# EAGLE design AOA-control-revD-sink (EAGLE 7.0.0)
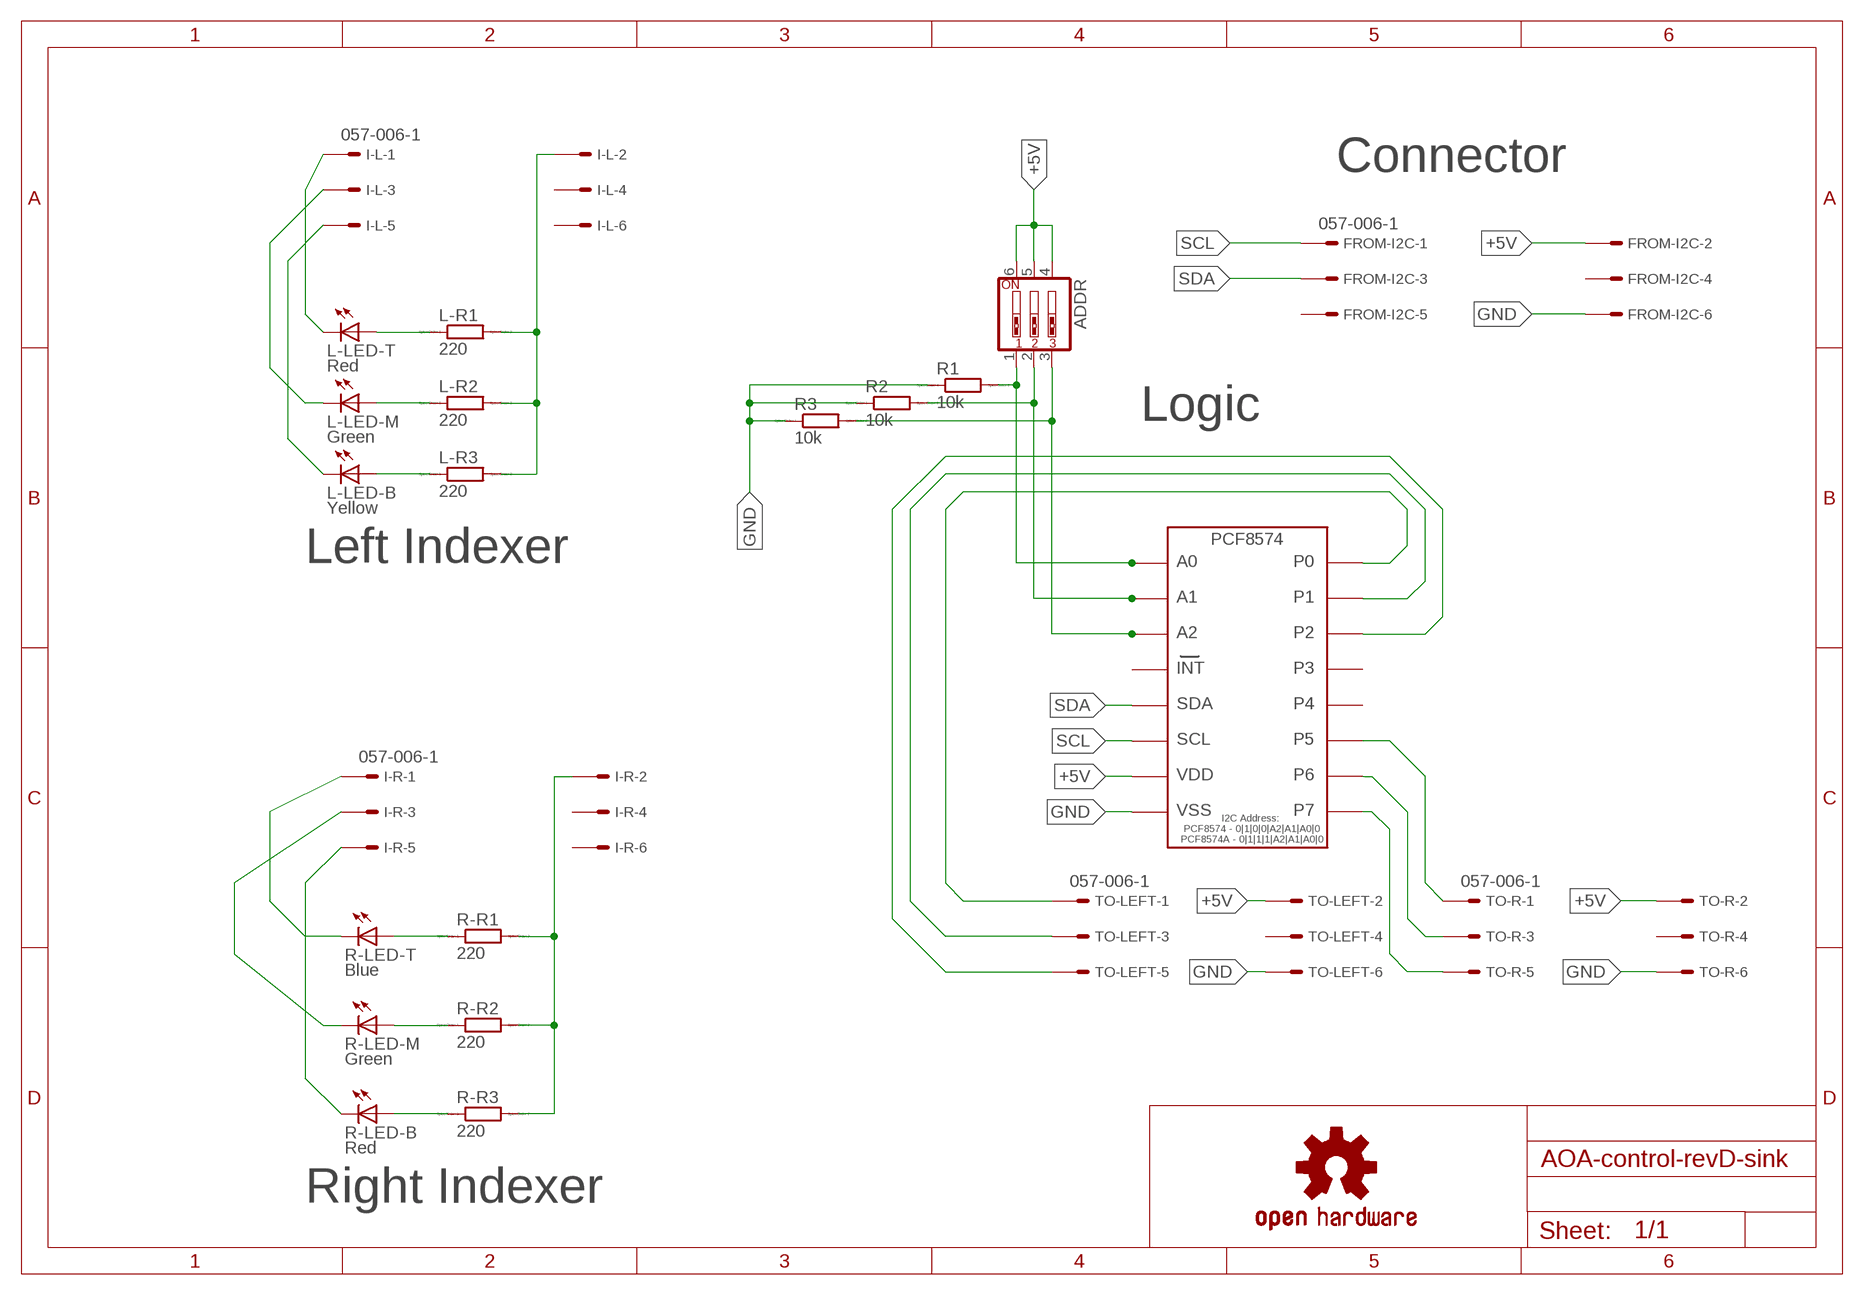
[diagram p0: schematic, sheet 1]

## Parts
ADDR  SW_DIP-3  [EDG-03]
FROM-I2C  057-006-1  [057-006-1]
I-L  057-006-1  [057-006-1]
I-R  057-006-1  [057-006-1]
L-LED-B  Yellow  LED-2AC-CP41B-WGS  [CP41B]
L-LED-M  Green  LED-2AC-CP41B-WGS  [CP41B]
L-LED-T  Red  LED-2AC-CP41B-WGS  [CP41B]
L-R1  220  R0204/7  [0204/7]
L-R2  220  R0204/7  [0204/7]
L-R3  220  R0204/7  [0204/7]
LOGO1  OSHW-LOGOS  [OSHW-LOGO-S]
R1  10k  R0204/7  [0204/7]
R2  10k  R0204/7  [0204/7]
R3  10k  R0204/7  [0204/7]
R-LED-B  Red  LED-2AC-CP41B-WGS  [CP41B]
R-LED-M  Green  LED-2AC-CP41B-WGS  [CP41B]
R-LED-T  Blue  LED-2AC-CP41B-WGS  [CP41B]
R-R1  220  R0204/7  [0204/7]
R-R2  220  R0204/7  [0204/7]
R-R3  220  R0204/7  [0204/7]
TO-LEFT  057-006-1  [057-006-1]
TO-R  057-006-1  [057-006-1]
U$1  PCF8574P/AP  [DIP16]

## Nets
5V-L [Power]: I-L.2 L-R1.2 L-R2.2 L-R3.2
5V-R [Power]: I-R.2 R-R1.2 R-R2.2 R-R3.2
+5V [Power]: ADDR.4 ADDR.5 ADDR.6 FROM-I2C.2 TO-LEFT.2 TO-R.2 U$1.VDD
A0 [Signal]: ADDR.1 R1.2 U$1.A0
A1 [Signal]: ADDR.2 R2.2 U$1.A1
A2 [Signal]: ADDR.3 R3.2 U$1.A2
GND [Power]: FROM-I2C.6 R1.1 R2.1 R3.1 TO-LEFT.6 TO-R.6 U$1.VSS
N$1 [Signal]: I-L.1 L-LED-T.1(C) L-LED-T.4(C)
N$2 [Signal]: I-L.3 L-LED-M.1(C) L-LED-M.4(C)
N$3 [Signal]: I-L.5 L-LED-B.1(C) L-LED-B.4(C)
N$4: R-LED-B.2(A) R-LED-B.3(A) R-R3.1
N$5 [Signal]: I-R.1 R-LED-T.1(C) R-LED-T.4(C)
N$6 [Signal]: I-R.3 R-LED-M.1(C) R-LED-M.4(C)
N$7 [Signal]: I-R.5 R-LED-B.1(C) R-LED-B.4(C)
N$8: R-LED-M.2(A) R-LED-M.3(A) R-R2.1
N$9: R-LED-T.2(A) R-LED-T.3(A) R-R1.1
N$10: L-LED-T.2(A) L-LED-T.3(A) L-R1.1
N$11 [Signal]: TO-LEFT.1 U$1.P0
N$12: L-LED-M.2(A) L-LED-M.3(A) L-R2.1
N$13: L-LED-B.2(A) L-LED-B.3(A) L-R3.1
N$14 [Signal]: TO-LEFT.3 U$1.P1
N$15 [Signal]: TO-LEFT.5 U$1.P2
N$16 [Signal]: TO-R.1 U$1.P5
N$17 [Signal]: TO-R.3 U$1.P6
N$18 [Signal]: TO-R.5 U$1.P7
SCL [Signal]: FROM-I2C.1 U$1.SCL
SDA [Signal]: FROM-I2C.3 U$1.SDA
Unconnected: FROM-I2C.4 FROM-I2C.5 I-L.4 I-L.6 I-R.4 I-R.6 TO-LEFT.4 TO-R.4 U$1.INT U$1.P3 U$1.P4

## Notes on the sheet
- Connector
- Logic
- Left Indexer
- Right Indexer

## Library data of the parts
ADDR = special:SW_DIP-3: DIP SWITCH
FROM-I2C I-L I-R TO-LEFT TO-R = con-panduit:057-006-: CONNECTOR 6-pin series 057 contact pc board low profile headers; OC_FARNELL: unknown; OC_NEWARK: unknown
L-LED-B L-LED-M L-LED-T R-LED-B R-LED-M R-LED-T = led:LED-2AC-: LEDs with 2 Cathode & 2 Anode - Kingbright SUPER FLUX LED LAMP Source: www.us.kingbright.com/images/catalog/SPEC/W7676CPBC-H.pdf Cree® P4 LED CP41B-WES/WGS Source: Data sheet <http://www.cree.com/products/pdf/LEDlamps/CP41B-WES&WGS.pdf>
L-R1-L-R3 R1-R3 R-R1-R-R3 = eagle-ltspice:R: RESISTOR, European symbol; SPICEMODEL: NONE; SPICEPREFIX: R
LOGO1 = SparkFun-Aesthetics:OSHW-LOGO: Open Source Hardware Logo This logo indicates the piece of hardware it is found on incorporates a OSHW license and/or adheres to the definition of open source hardware found here: http://freedomdefined.org/OSHW
U$1 = Uri_ba:PCF8574: NXP PCF8574 I2C 8 bit I/O expander

## Net classes
1 Signal: width 0.254 mm, drill 0.254 mm, clearance 0.254 mm
2 Power: width 0.406 mm, drill 0.406 mm, clearance 0.406 mm

## Board
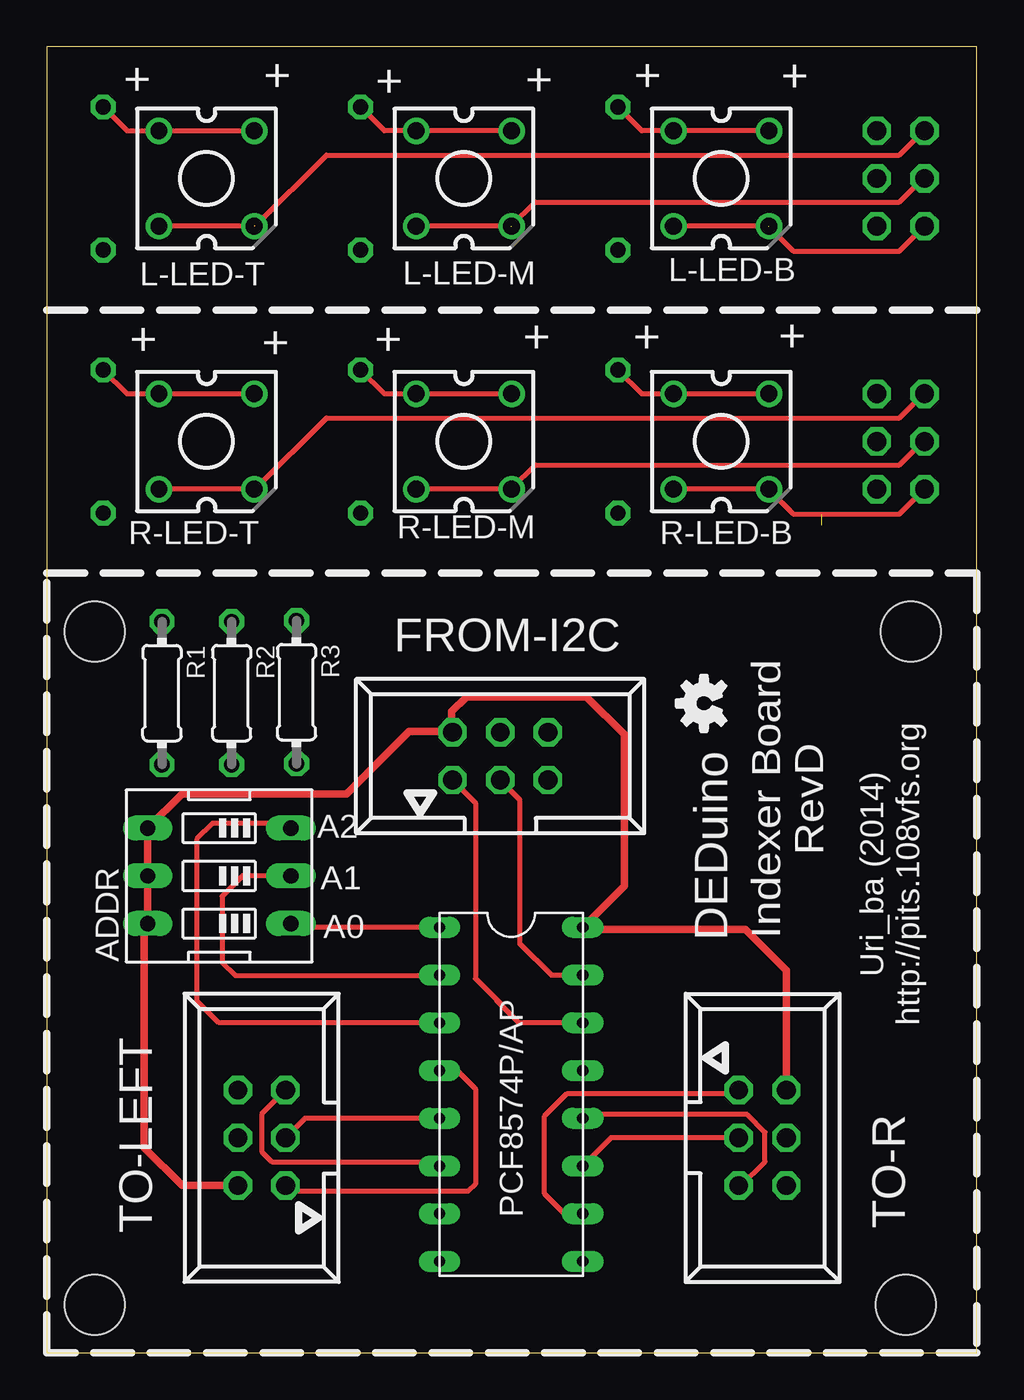
[diagram p1: board, top side]
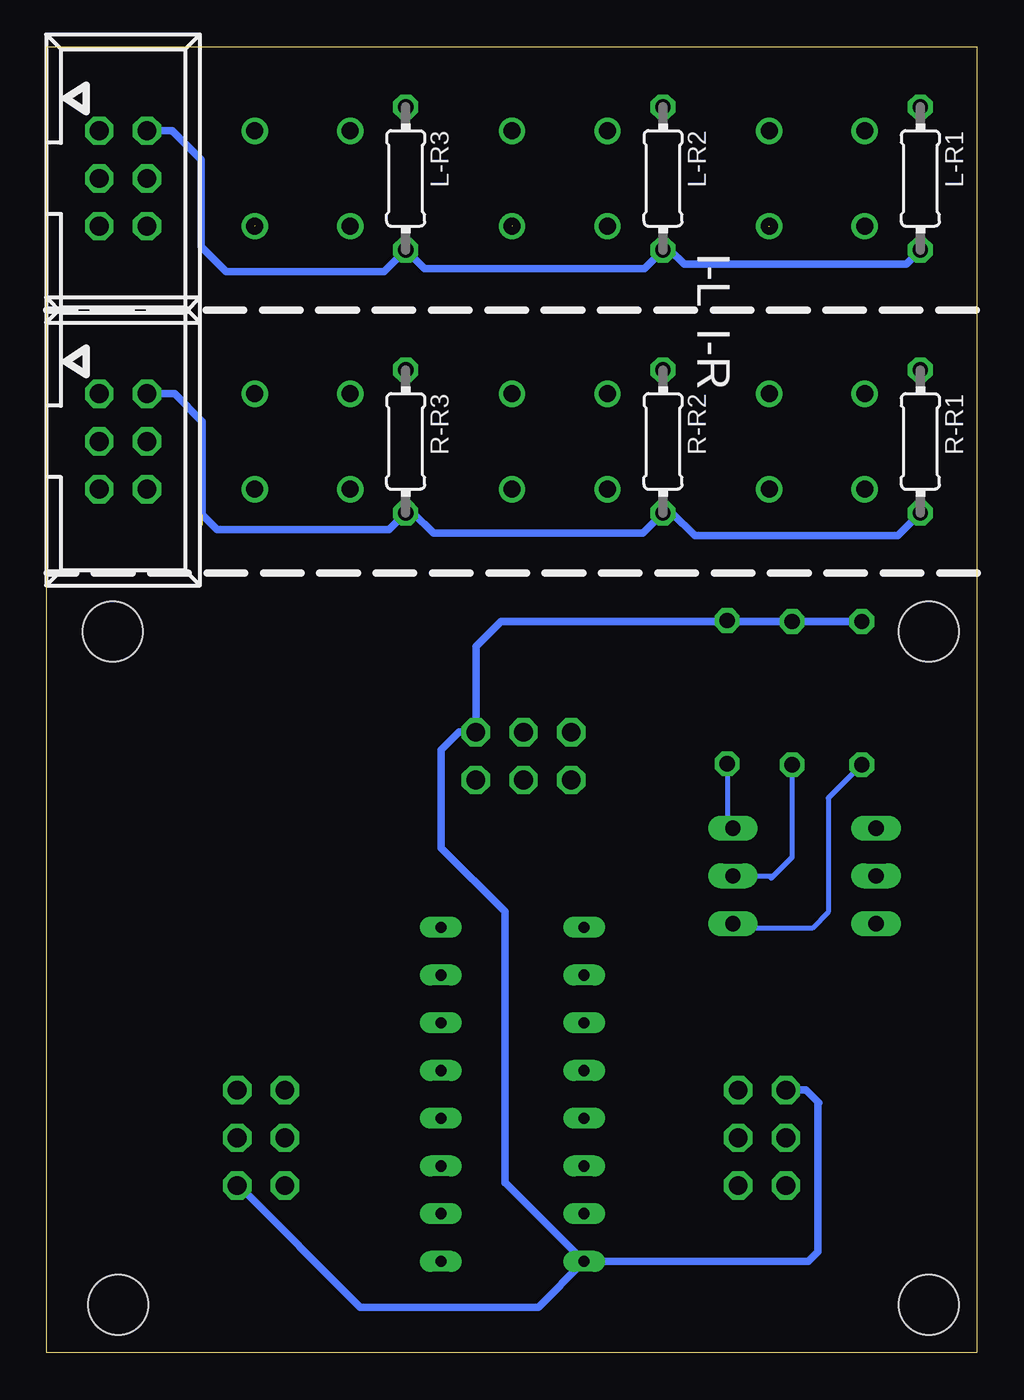
[diagram p2: board, bottom side, seen from below]

Size 49.5 x 69.5 mm. Coordinates in mm from the lower left corner, seen from the top.
Outline: 0,0 49.5,0 49.5,69.5 0,69.5 0,0
Copper layers (1*16): Top 0.035mm / dielectric 1.5mm / Bottom 0.035mm
Design rules "ITEADstudio_DRC": minimum track width 6mil, minimum drill 12mil, track to track 6mil, track to pad 6mil, pad to pad 6mil, via to via 6mil, smd to smd 0mil, copper to edge 10mil, drill to drill 10mil, minimum pad ring 10mil, minimum via ring 6mil, stop-mask expansion 2mil, vias tented up to drill 100mil, thermal gap 10mil
Holes 3.2 mm at 2.54,38.37 45.72,2.54 45.99,38.37 2.54,2.54

### Footprints (pad centres in the part's own frame; a part is rotated, then mirrored left to right if it is on the bottom)
EDG-03 = drill 0.813 long: 1 -2.54,-3.81; 2 0,-3.81; 3 2.54,-3.81; 4 2.54,3.81; 5 0,3.81; 6 -2.54,3.81
057-006-1 = drill 1 octagon: 1 -2.54,-1.27; 2 -2.54,1.27; 3 0,-1.27; 4 0,1.27; 5 2.54,-1.27; 6 2.54,1.27
CP41B = drill 0.9 pad 1.27: 1 -2.54,2.54; 2 -2.54,-2.54; 3 2.54,-2.54; 4 2.54,2.54
0204/7 = drill 0.813 octagon: 1 -3.81,0; 2 3.81,0
DIP16 = drill 0.6 long: A0 -3.81,11.43; A1 -3.81,8.89; A2 -3.81,6.35; INT 3.81,3.81; P0 -3.81,3.81; P1 -3.81,1.27; P2 -3.81,-1.27; P3 -3.81,-3.81; P4 3.81,-6.35; P5 3.81,-3.81; P6 3.81,-1.27; P7 3.81,1.27; SCL 3.81,6.35; SDA 3.81,8.89; VDD 3.81,11.43; VSS -3.81,-6.35

### Placement (x,y rotation side)
ADDR  9.17,25.37 90 top
FROM-I2C  24.13,31.75 0 top
I-L  45.45,62.5 270 bottom
I-R  45.45,48.5 270 bottom
L-LED-B  35.9,62.5 180 top
L-LED-M  22.2,62.5 180 top
L-LED-T  8.5,62.5 180 top
L-R1  3,62.5 270 bottom
L-R2  16.7,62.5 270 bottom
L-R3  30.4,62.5 270 bottom
LOGO1  34.98,34.56 90 top
R1  6.12,35.1 270 top
R2  9.83,35.1 270 top
R3  13.28,35.15 270 top
R-LED-B  35.9,48.5 180 top
R-LED-M  22.2,48.5 180 top
R-LED-T  8.5,48.5 180 top
R-R1  3,48.5 270 bottom
R-R2  16.7,48.5 270 bottom
R-R3  30.4,48.5 270 bottom
TO-LEFT  11.43,11.43 90 top
TO-R  38.1,11.43 270 top
U$1  24.71,11.2 0 top

### Tracks (layer width: path | path; a pad name or v marks a point on that pad's centre or on a via)
5V-L
  Bottom 0.406: L-R1.2 3.75,57.94 15.57,57.94 16.32,58.69 L-R2.2 17.68,57.71 29.39,57.71 30.37,58.69 L-R3.2 31.56,57.53 39.95,57.53 41.3,58.88 41.3,63.5 42.84,65.04 I-L.2
5V-R  (1 unrouted)
  Bottom 0.406: R-R1.2 4.21,43.48 15.01,43.48 16.22,44.69 R-R2.2 17.78,43.61 28.93,43.61 30.01,44.69 R-R3.2 31.27,43.81 40.44,43.81 41.22,44.6 41.22,49.55 42.71,51.04 I-R.2
+5V
  Top 0.406: 21.54,33.07 21.54,34.11 22.33,34.9 28.73,34.9 30.73,32.89 30.73,24.84 U$1.VDD 28.63,22.53 37.19,22.53 39.37,20.34 TO-R.2 | 21.54,33.07 FROM-I2C.2 | 21.54,33.07 19.28,33.07 15.95,29.74 7.19,29.74 ADDR.4 ADDR.5 ADDR.6 5.18,22.66 5.18,10.9 7.19,8.89 TO-LEFT.2
A0
  Top 0.254: U$1.A0 13.18,22.63 ADDR.1
  Bottom 0.254: ADDR.1 12.72,22.58 8.76,22.58 7.9,23.44 7.9,29.52 R1.2
A1
  Top 0.254: ADDR.2 10.41,25.38 9.32,24.28 9.32,20.78 10.03,20.07 20.88,20.07 U$1.A1
  Bottom 0.254: R2.2 9.83,26.36 10.79,25.4 10.82,25.38 | 10.82,25.38 10.95,25.25 | ADDR.2 10.82,25.38
A2
  Top 0.254: ADDR.3 12.98,28.12 13.03,28.17 | 13.03,28.17 13.08,28.17 | 13.03,28.17 8.81,28.17 7.98,27.33 7.98,18.72 9.12,17.58 20.88,17.58 U$1.A2
  Bottom 0.254: R3.2 13.28,28.22 ADDR.3
GND
  Bottom 0.406: U$1.VSS 25.09,9.04 25.12,9.04 25.12,23.47 28.52,26.87 28.52,32.08 27.56,33.05 26.7,33.05 FROM-I2C.6 26.64,33.05 26.64,37.59 25.32,38.91 13.23,38.91 | U$1.VSS 8.97,4.85 8.46,5.36 8.46,13.23 8.41,13.28 9.09,13.97 TO-LEFT.6 | 13.23,38.91 R3.1 | 13.23,38.91 R2.1 R1.1 | TO-R.6 39.29,8.89 32.82,2.41 23.34,2.41 U$1.VSS
N$1  (1 unrouted)
  Top 0.254: I-L.1 46.62,65 45.38,63.75 14.88,63.75 11.09,59.96 L-LED-T.4
N$2  (1 unrouted)
  Top 0.254: I-L.3 46.62,62.5 45.38,61.25 26,61.25 24.71,59.96 L-LED-M.4
N$3  (1 unrouted)
  Top 0.254: I-L.5 46.62,59.88 45.38,58.62 39.75,58.62 38.41,59.96 L-LED-B.4
N$4
  Top 0.254: R-R3.1 31.67,51.04 R-LED-B.3 R-LED-B.2
N$5
  Top 0.254: I-R.1 46.62,51 45.38,49.75 14.88,49.75 11.09,45.96 R-LED-T.1 R-LED-T.4
N$6
  Top 0.254: I-R.3 46.62,48.5 45.38,47.25 26,47.25 24.74,45.99 R-LED-M.1 R-LED-M.4
N$7
  Top 0.254: I-R.5 46.62,45.88 45.38,44.62 39.75,44.62 38.44,45.94 R-LED-B.1 R-LED-B.4
N$8
  Top 0.254: R-R2.1 17.97,51.04 R-LED-M.3 R-LED-M.2
N$9
  Top 0.254: R-R1.1 4.27,51.04 R-LED-T.3 R-LED-T.2
N$10
  Top 0.254: L-R1.1 4.27,65.04 L-LED-T.3 L-LED-T.2
N$11
  Top 0.254: U$1.P0 21.84,15.01 22.81,14.05 22.81,8.97 22.43,8.59 13.01,8.59 TO-LEFT.1
N$12
  Top 0.254: L-LED-M.2 L-LED-M.3 17.97,65.04 L-R2.1
N$13
  Top 0.254: L-LED-B.2 L-LED-B.3 31.67,65.04 L-R3.1
N$14
  Top 0.254: U$1.P1 13.74,12.47 TO-LEFT.3
N$15
  Top 0.254: TO-LEFT.5 11.43,12.7 11.43,10.69 11.96,10.16 20.68,10.16 U$1.P2
N$16
  Top 0.254: U$1.P5 27.56,7.39 26.49,8.46 26.49,12.6 27.69,13.79 36.65,13.79 TO-R.1
N$17
  Top 0.254: TO-R.3 30.02,11.43 U$1.P6
N$18
  Top 0.254: TO-R.5 36.96,8.89 38.23,10.16 38.23,11.73 37.29,12.68 28.73,12.68 U$1.P7
SCL
  Top 0.254: U$1.SCL 25.12,17.55 24.24,18.43 | 24.24,18.43 23.95,18.72 | FROM-I2C.1 22.81,29.26 22.81,19.91 24.24,18.48 24.24,18.43
SDA
  Top 0.254: FROM-I2C.3 25.17,29.44 25.17,21.77 26.85,20.09 U$1.SDA

### Text on the board
tNames: + | + | + | + | + | + | + | + | + | + | + | + | DEDuino | A2 | Indexer Board / RevD | A1 | Uri_ba (2014) / http://pits.108vfs.org | A0